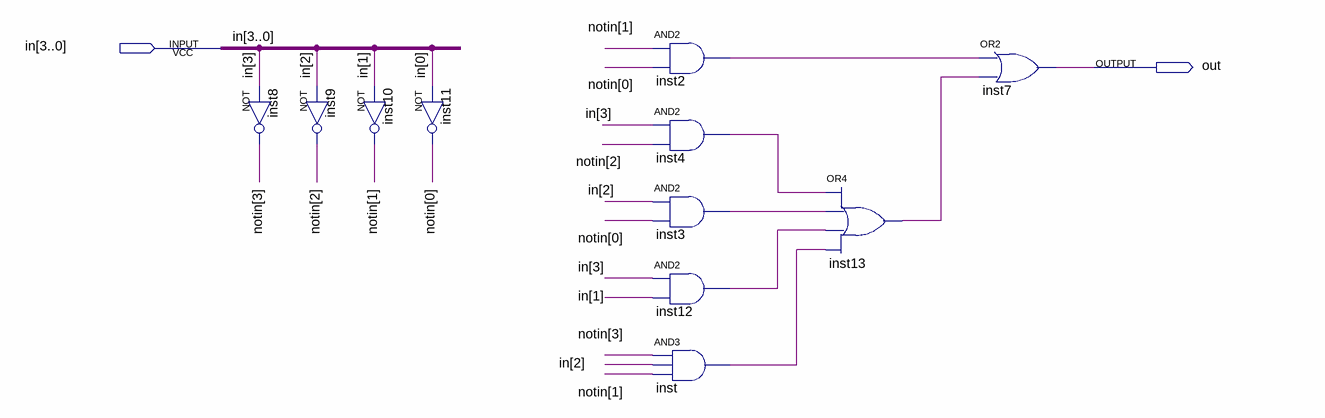
[diagram p0: schematic sheet]
// Quartus schematic d5.bdf as structural Verilog: 11 symbols, 2 pins
module d5 (
  input  [3:0] in,
  output out
);

  wire inst2_out, inst3_out, inst4_out, inst12_out, inst13_out, inst_out;
  wire [3:0] notin;

  not inst8 (notin[3], in[3]);
  not inst9 (notin[2], in[2]);
  not inst10 (notin[1], in[1]);
  not inst11 (notin[0], in[0]);
  and inst2 (inst2_out, notin[1], notin[0]);
  and inst4 (inst4_out, in[3], notin[2]);
  and inst3 (inst3_out, in[2], notin[0]);
  and inst12 (inst12_out, in[3], in[1]);
  and inst (inst_out, notin[3], in[2], notin[1]);
  or inst13 (inst13_out, inst4_out, inst3_out, inst12_out, inst_out);
  or inst7 (out, inst2_out, inst13_out);
endmodule
